# EAGLE schematic opam_int (EAGLE 9.6.2)
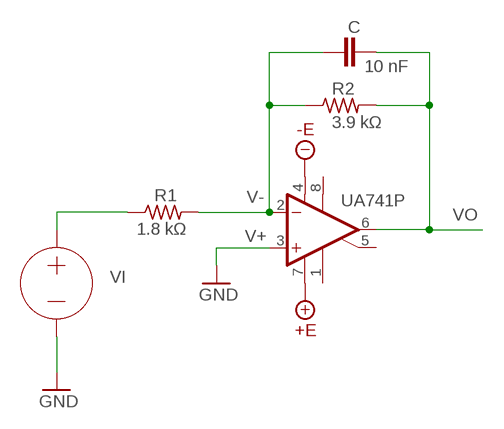
[diagram p0: schematic, sheet 1]

## Parts
C  10 nF  C-EU025-024X044  [C025-024X044]
IC1  UA741P  [DIL08]
R1  1.8 kΩ  R-US_0204/2V  [0204V]
R2  3.9 kΩ  R-US_0204/2V  [0204V]
VI  0V  VOLTAGE  (no package)

## Nets
+10V: IC1.7(V+)
-10V: IC1.4(V-)
GND: IC1.3(+IN) VI.-
V-: C.1 IC1.2(-IN) R1.2 R2.1
VI: R1.1 VI.+
VO: C.2 IC1.6(OUT) R2.2
Unconnected: IC1.1(ON1) IC1.5(ON2) IC1.8(OPT)

## Notes on the sheet
- -E
- V+
- +E

## Library data of the parts
C = rcl:C-EU: CAPACITOR, European symbol; SPICEPREFIX: C
IC1 = linear:*741: OP AMP
R1 R2 = rcl:R-US_: RESISTOR, American symbol; SPICEPREFIX: R
VI = ngspice-simulation:VOLTAGE: Independent Voltage Source, either DC, AC, PULSE, SINE, PWL, EXP, or SFFM